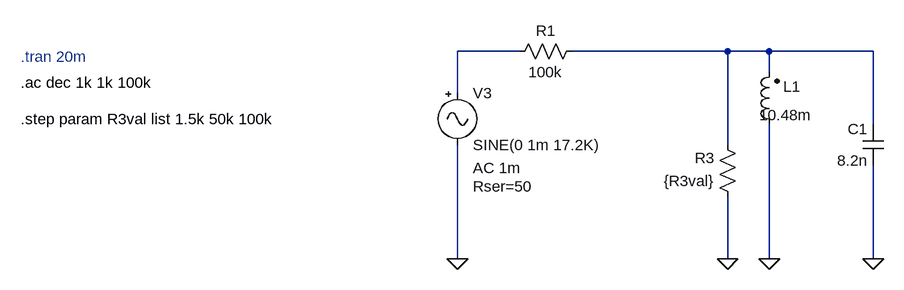
[diagram p0: schematic SAQ_LC.asc]
SAQ_LC.asc, the LTspice schematic file:
Version 4
SHEET 1 14772 7332
WIRE 11264 5120 11168 5120
WIRE 11584 5120 11344 5120
WIRE 11648 5120 11584 5120
WIRE 11808 5120 11648 5120
WIRE 11648 5152 11648 5120
WIRE 11168 5184 11168 5120
WIRE 11808 5232 11808 5120
WIRE 11584 5264 11584 5120
WIRE 11168 5440 11168 5264
WIRE 11584 5440 11584 5344
WIRE 11648 5440 11648 5232
WIRE 11808 5440 11808 5296
FLAG 11648 5440 0
FLAG 11168 5440 0
FLAG 11584 5440 0
FLAG 11808 5440 0
SYMBOL ind2 11664 5248 R180
WINDOW 0 -33 74 Left 2
WINDOW 3 -50 30 Left 2
SYMATTR InstName L1
SYMATTR Value 10.48m
SYMATTR Type ind
SYMBOL Misc\\signal 11168 5168 R0
WINDOW 123 24 132 Left 2
WINDOW 39 24 160 Left 2
SYMATTR Value2 AC 1m
SYMATTR SpiceLine Rser=50
SYMATTR InstName V3
SYMATTR Value SINE(0 1m 17.2K)
SYMBOL cap 11824 5296 R180
WINDOW 0 24 56 Left 2
WINDOW 3 24 8 Left 2
SYMATTR InstName C1
SYMATTR Value 8.2n
SYMBOL res 11600 5360 R180
WINDOW 0 36 76 Left 2
WINDOW 3 36 40 Left 2
SYMATTR InstName R3
SYMATTR Value {R3val}
SYMBOL res 11360 5104 R90
WINDOW 0 0 56 VBottom 2
WINDOW 3 32 56 VTop 2
SYMATTR InstName R1
SYMATTR Value 100k
TEXT 10496 5128 Left 2 ;.tran 20m
TEXT 10496 5168 Left 2 !.ac dec 1k 1k 100k
TEXT 10496 5224 Left 2 !.step param R3val list 1.5k 50k 100k

The netlist it stands for:
* SAQ_LC.asc
L1 0 N002 10.48m
V3 N001 0 SINE(0 1m 17.2K) AC 1m Rser=50
C1 0 N002 8.2n
R3 0 N002 {R3val}
R1 N002 N001 100k
* .tran 20m
.ac dec 1k 1k 100k
.step param R3val list 1.5k 50k 100k
.backanno
.end